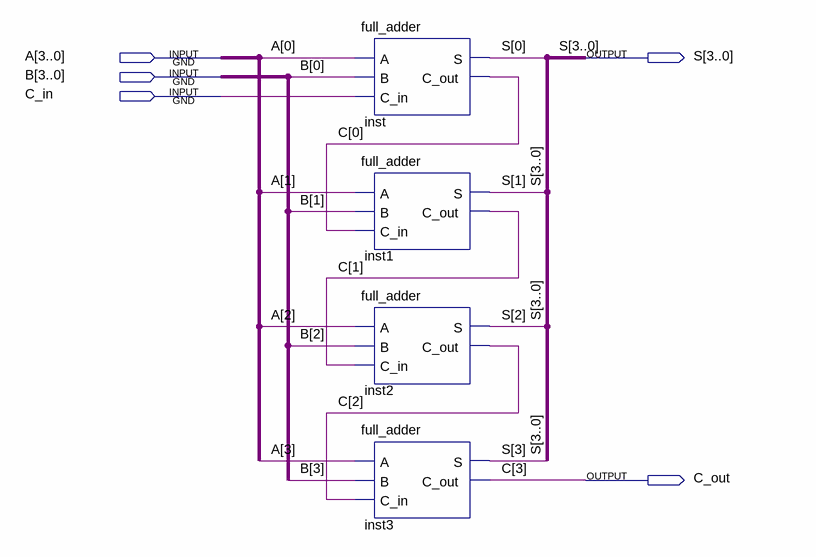
[diagram p0: schematic sheet]
// Quartus schematic adder4.bdf as structural Verilog: 4 symbols, 5 pins
module adder4 (
  input  [3:0] A,
  input  [3:0] B,
  input  C_in,
  output [3:0] S,
  output C_out
);

  wire [2:0] C;

  full_adder inst (.A(A[0]), .B(B[0]), .C_in(C_in), .S(S[0]), .C_out(C[0]));
  full_adder inst1 (.A(A[1]), .B(B[1]), .C_in(C[0]), .S(S[1]), .C_out(C[1]));
  full_adder inst2 (.A(A[2]), .B(B[2]), .C_in(C[1]), .S(S[2]), .C_out(C[2]));
  full_adder inst3 (.A(A[3]), .B(B[3]), .C_in(C[2]), .S(S[3]), .C_out(C_out));

  // Other names for the same wires on the sheet: C[3] = C_out
endmodule
